# Altium schematic sheet power.SchDoc
size A4
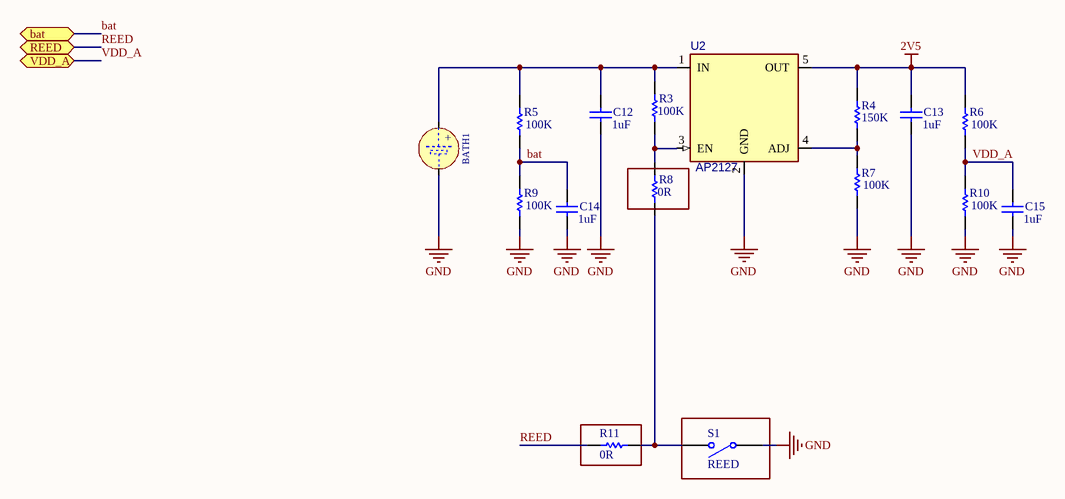
[diagram p0: power.SchDoc]

## Parts
BATH1  (no value)  [BATH_KEYSTONE_3000]
C12  value 1uF  [0805]  (hidden comment: C0805)
C13  value 1uF  [0805]  (hidden comment: C0805)
C14  value 1uF  [0805]  (hidden comment: C0805)
C15  value 1uF  [0805]  (hidden comment: C0805)
R3  value 100K  [ERA-0805]  (hidden comment: ERA6Y)
R4  value 150K  [ERA-0805]  (hidden comment: ERA6Y)
R5  value 100K  [ERA-0805]  (hidden comment: ERA6Y)
R6  value 100K  [ERA-0805]  (hidden comment: ERA6Y)
R7  value 100K  [ERA-0805]  (hidden comment: ERA6Y)
R8  value 0R  [ERA-0805]  (hidden comment: ERA6Y)
R9  value 100K  [ERA-0805]  (hidden comment: ERA6Y)
R10  value 100K  [ERA-0805]  (hidden comment: ERA6Y)
R11  value 0R  [ERA-0805]  (hidden comment: ERA6Y)
S1  REED  [SPST-2]
U2  value AP2127  [SOT-25]  (hidden comment: 000000)

## Ports
bat, REED, VDD_A

## Nets
2V5: C13.2 R4.2 R6.2 U2.5(OUT)
GND: BATH1.2(MINUS) C12.1 C13.1 C14.1 C15.1 R7.1 R9.1 R10.1 S1.1(COMMON) U2.2(GND)
bat: C14.2 R5.1 R9.2 ; port bat
REED: R11.2 ; port REED
VDD_A: C15.2 R6.1 R10.2 ; port VDD_A
NetBATH1_1: BATH1.1(PLUS) C12.2 R3.2 R5.2 U2.1(IN)
NetR3_1: R3.1 R8.2 U2.3(EN)
NetR4_1: R4.1 R7.2 U2.4(ADJ)
NetR8_1: R8.1 R11.1 S1.2(NO)

## Notes on the sheet
- (in symbol BATH_KEYSTONE_3000) +

## Library data of the parts
BATH1 = BATH_KEYSTONE_3000: Battery Holder whit 2 Pin; Part Description: SMD Battery Holders for BR1216, CR1216, BR1220, CL1220, CR1220, BR1225 Coin Cells; Manufacturer Part Number: 3000; Table: Batteries; Part Number: BATH_KEYSTONE_3000; Component Kind: Standard; Component Type: Standard; Pin Count: 3; PackageDescription: SMD Battery Holders for BR1216, CR1216, BR1220, CL1220, CR1220, BR1225 Coin Cells; Family: Battery; Mounted: Yes; Socket: No; SMD: No; Manufacturer: KEYSTONE; ComponentHeight: 3.17mm; HelpURL: \\cern.ch\dfs\Applications\Altium\Datasheets\BATH_KEYSTONE_3000.pdf; Author: CERN DEM JLC; CreateDate: 17.04.2012; LatestRevisionDate: 17.04.2012
C12-C15 = C0805: Ceramic Chip Capacitor - Standard; Note: Footprint corresponds to dimensions for bulk cassette packaging. This case size has tightened tolerances.; Published: 17-Jul-2002; LatestRevisionDate: 19-Mar-2004; LatestRevisionNote: Silkscreen size reduced.; DatasheetDocument: Mar-2001; PackageDocument: Mar-2001; PackageReference: 0805; Publisher: Altium Limited; Code_JEITA: 0805; Code_IPC: 2012[0805]; ComponentLink1Description: Manufacturer Link; ComponentLink1URL: http://www.kemet.com/; ComponentLink2Description: Datasheet; ComponentLink2URL: http://www.kemet.com/kemet/web/homepage/kechome.nsf/vapubfilesname/F3102TA.pdf/$file/F3102TA.pdf
R3-R11 = ERA6Y: Rectangular Thick Film Chip Resistor, 10 Ohm to 1M Ohm Range, 0.1% and 0.5% Tolerance, 0805 Size, 0.1 W; Note: If flow soldering, adjust pad width of PCB Footprint to 0.7 - 0.8 times the width of the resistor.; Published: 17-Dec-2003; LatestRevisionDate: 19-Mar-2004; LatestRevisionNote: Silkscreen size reduced.; PackageDocument: Mar-2003; PackageReference: ERA-0805; Publisher: Altium Limited; Code_IPC: 2012 [0805]; ComponentLink1Description: Manufacturer Link; ComponentLink1URL: http://www.panasonic.com/industrial/components/resistive_products.htm; ComponentLink2Description: Datasheet; ComponentLink2URL: http://www.panasonic.com/industrial/components/pdf/AOA0000CE8.pdf
S1 = SW-SPST: Single-Pole, Single-Throw Switch; Published: 24-Mar-1999; LatestRevisionDate: 17-Jul-2002; LatestRevisionNote: Re-released for DXP Platform.; PackageReference: SPST-2; Publisher: Altium Limited; PackageDescription: Switch; 2 Leads
U2 = AP7331-WG: LDO 300mA,  Low Quiescent Current, Fast Transient; Package: SOT23-5; PN: 000000; ExtraInfo: *